# Altium project 海关全向控制器开关转接板V4.PrjPcb
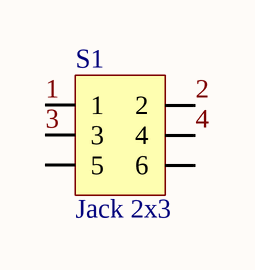
[diagram p0: 海关全向控制器开关转接板V4.SchDoc]
1 sheet, 1 parts. Net scope: global (net labels, ports and power ports of the same name join across sheets).
Board file: 海关全向控制器开关转接板V4.PcbDoc

## Sheet 海关全向控制器开关转接板V4.SchDoc
size A4

### Parts
S1  Jack 2x3  [SW_6x6_SMD]

### Nets
1: S1.1
2: S1.2
3: S1.3
4: S1.4

Not connected (* = marked no-connect by the designer): S1 5 6

### Notes on the sheet
- 文件名:
- 审核:
- 制图人:
- 孟浩
- 校对:
- 图号:
- 批准:
- 日期:

### Library data of the parts
S1 = Jack 2x3: 双排座